# Altium schematic sheet Regulador_3.3V.SchDoc
size A4
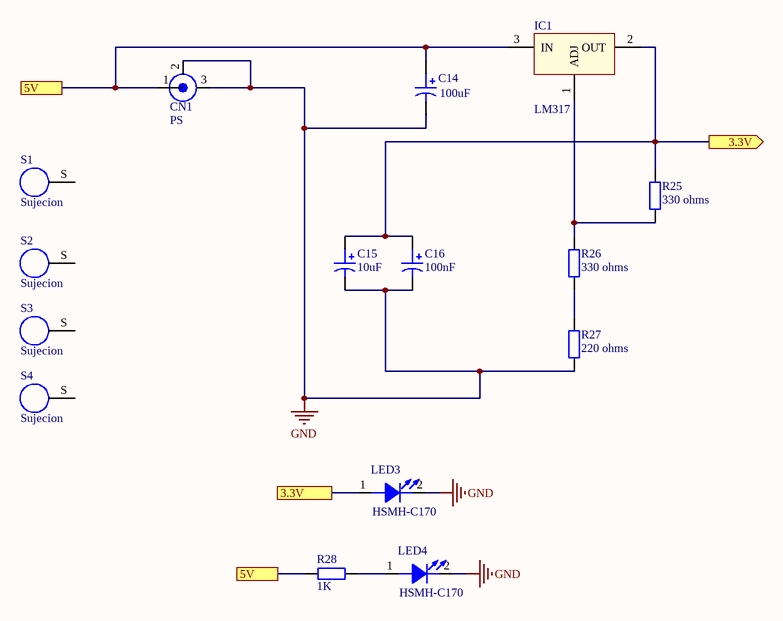
[diagram p0: Regulador_3.3V.SchDoc]

## Parts
C14  value 100uF  [RADIAL C]  (hidden comment: Cap Pol)
C15  value 10uF  [RADIAL C]  (hidden comment: Cap Pol)
C16  value 100nF  [RADIAL C]  (hidden comment: Cap Pol)
CN1  PS  [JACK DC]
IC1  LM317  [QTO-220]
LED3  HSMH-C170  [LED.SMD.WHITE]
LED4  HSMH-C170  [LED.SMD.WHITE]
R25  330 ohms  [SM-1206]
R26  330 ohms  [SM-1206]
R27  220 ohms  [SM-1206]
R28  1K  [SM-1206]
S1  Sujecion  [SUJECION]
S2  Sujecion  [SUJECION]
S3  Sujecion  [SUJECION]
S4  Sujecion  [SUJECION]

## Ports
3.3V, 3.3V (out), 5V

## Nets
GND: C14.2 C15.2 C16.2 CN1.2(SHIELD) CN1.3(SHIELD) LED3.2(K) LED4.2(K) R27.2
3.3V: C15.1 C16.1 IC1.2(OUT) LED3.1(A) R25.2 ; port 3.3V
5V: C14.1 CN1.1(CENTER) IC1.3(IN) R28.1 ; port 5V
NetIC1_1: IC1.1(ADJ) R25.1 R26.1
NetLED4_1: LED4.1(A) R28.2
NetR26_2: R26.2 R27.1

Not connected (* = marked no-connect by the designer): S1 S; S2 S; S3 S; S4 S

## Library data of the parts
C14-C16 = Cap Pol: Polarized Capacitor; Published: 8-Jun-2000; LatestRevisionDate: 17-Jul-2002; LatestRevisionNote: Re-released for DXP Platform.; PackageReference: POLAR0.8; Publisher: Altium Limited
CN1 = CON.DCjack: DC Power Jack, 2.5mm, KLD Series, PCB Mount; Vendor: Nhat Tao; ComponentLink1Description: Digikey Part link; ComponentLink2Description: Open DataSheet; ComponentLink2URL: H:\LIBRARY\LIBRARY.Datasheet\; Price: 1.500VND
IC1 = LM317_1: Adj Voltage +1.2 -> +37V; Value: LM317
LED3 LED4 = LED_1: Typical GaAs SMD LED; Manufacturer: Lite-On Inc; Color: RED; Type: Cong ty RP; Vendor: Digikey; Publisher: Hoang Nguyen; Price: *; Published: 13-April-2009; ComponentLink1Description: Digikey Part Link; ComponentLink2Description: Open Datasheet; ComponentLink2URL: H:\LIBRARY\LIBRARY.Datasheet\
R25-R27 = RM: Resistor SMD; Value: 1K
R28 = RM: Resistor SMD; Value: 1K